# Altium schematic sheet schematic.SchDoc
size A; SheetNumber: 2; SheetTotal: 2
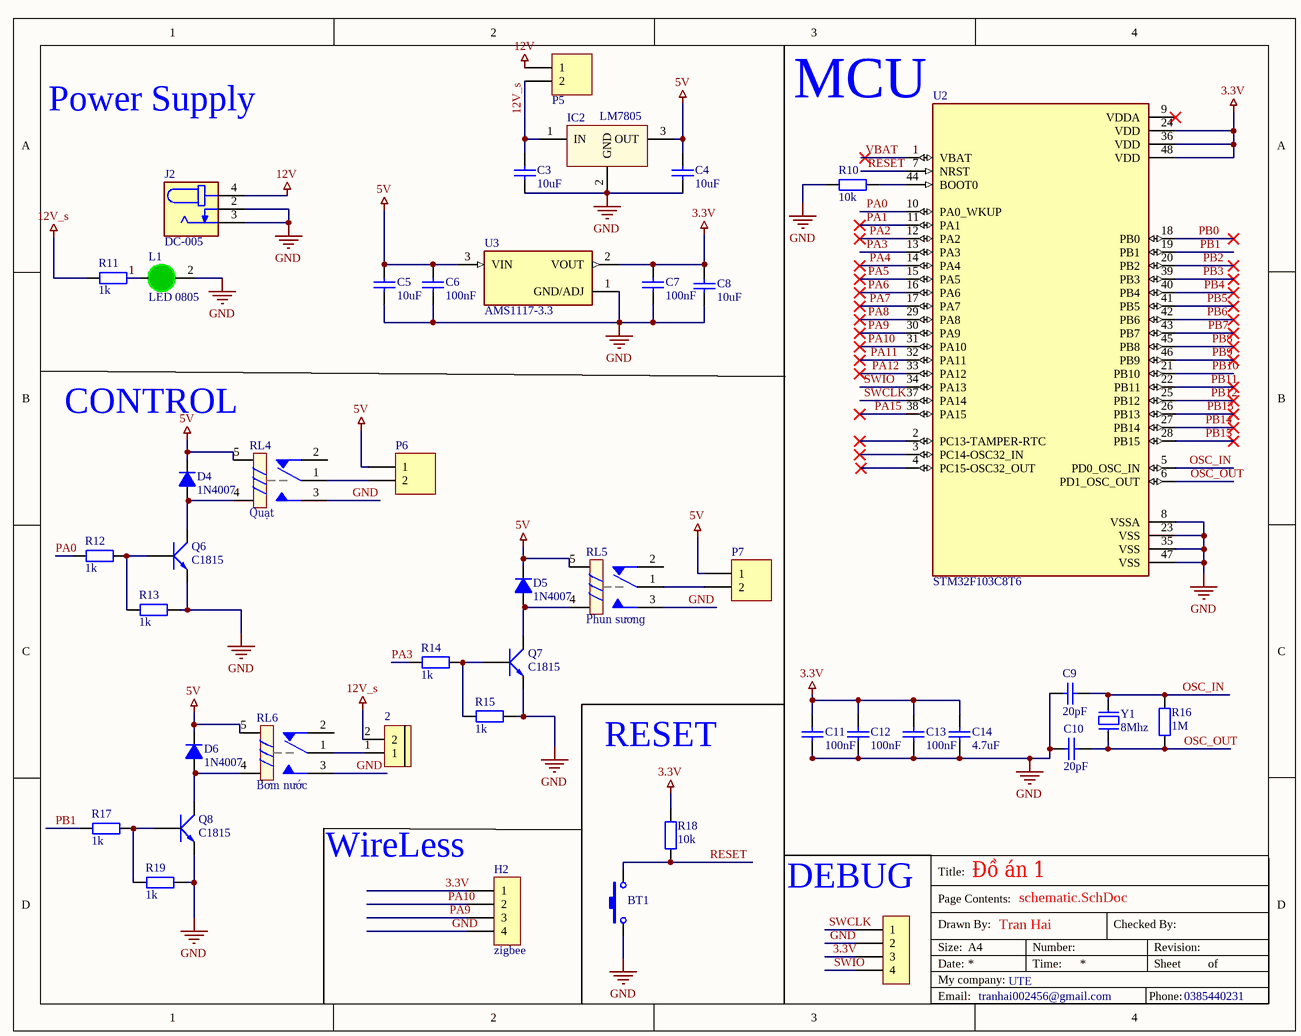
[diagram p0: schematic.SchDoc]

## Parts
2  CON 2 KF301  [Con 2 KF301 5.08]  (value not drawn)
BT1  Nut Nhan 2 Chan SMD 3x6x2.5  [Nut Nhan 2 Chan SMD 3x6x2.5]  (value not drawn)
C3  10uF  [tu 0805]
C4  10uF  [tu 0805]
C5  10uF  [Tu 0805]
C6  100nF  [Tu 0805]
C7  100nF  [Tu 0805]
C8  10uF  [Tu 0805]
C9  20pF  [tu 0805]
C10  20pF  [tu 0805]
C11  100nF  [tu 0805]
C12  100nF  [tu 0805]
C13  100nF  [tu 0805]
C14  4.7uF  [tu 0805]
D4  1N4007  [D1A]
D5  1N4007  [D1A]
D6  1N4007  [D1A]
H2  zigbee  [XH2.54M-4]
H3  Header 4P 2.54 Duc Thang  [XH2.54M-4]  (value not drawn)
IC2  LM7805  [QTO-220]
J2  DC-005  [NINIGI_DC-005]
L1  LED 0805  [LED-0805-Green]
P5  Header 2  [HDR1X2]  (value not drawn)
P6  Header 2  [HDR1X2]  (value not drawn)
P7  Header 2  [HDR1X2]  (value not drawn)
Q6  C1815  [TO92]
Q7  C1815  [TO92]
Q8  C1815  [TO92]
R10  10k  [tro smd 0805]
R11  1k  [tro smd 0805]
R12  1k  [R1/4W]
R13  1k  [R1/4W]
R14  1k  [R1/4W]
R15  1k  [R1/4W]
R16  1M  [tro smd 0805]
R17  1k  [R1/4W]
R18  10k  [tro smd 0805]
R19  1k  [R1/4W]
RL4  Quạt  [Relay 5 Chan SRD]
RL5  Phun sương  [Relay 5 Chan SRD]
RL6  Bơm nước  [Relay 5 Chan SRD]
U2  STM32F103C8T6  [QFP50P900X900X160-48N]
U3  AMS1117-3.3  [SOT229P700X180-4N]
Y1  8Mhz  [Thach Anh 2 chan cam]

## Nets
3.3V: C7.1 C8.1 C11.1 C12.1 C13.1 C14.1 H2.1 H3.3 R18.2 U2.24(VDD) U2.36(VDD) U2.48(VDD) U3.2(VOUT)
5V: C4.1 C5.1 C6.1 D4.2(K) D5.2(K) D6.2(K) IC2.3(OUT) P6.1 P7.1 RL4.5 RL5.5 RL6.5 U3.3(VIN)
12V: J2.4 P5.1
12V_s: 2.2 C3.1 IC2.1(IN) P5.2 R11.1
GND: BT1.1 C3.2 C4.2 C5.2 C6.2 C7.2 C8.2 C9.2 C10.2 C11.2 C12.2 C13.2 C14.2 H2.4 H3.2 IC2.2(GND) J2.2 J2.3 L1.2(K) Q6.1(E) Q7.1(E) Q8.1(E) R10.1 R13.2 R15.2 R19.2 RL4.3 RL5.3 RL6.3 U2.8(VSSA) U2.23(VSS) U2.35(VSS) U2.47(VSS) U3.1(GND/ADJ)
OSC_IN: C9.1 R16.2 U2.5(PD0_OSC_IN) Y1.2
OSC_OUT: C10.1 R16.1 U2.6(PD1_OSC_OUT) Y1.1
PA0: R12.1 U2.10(PA0_WKUP)
PA1: U2.11(PA1)
PA2: U2.12(PA2)
PA3: R14.1 U2.13(PA3)
PA4: U2.14(PA4)
PA5: U2.15(PA5)
PA6: U2.16(PA6)
PA7: U2.17(PA7)
PA8: U2.29(PA8)
PA9: H2.3 U2.30(PA9)
PA10: H2.2 U2.31(PA10)
PA11: U2.32(PA11)
PA12: U2.33(PA12)
PA15: U2.38(PA15)
PB0: U2.18(PB0)
PB1: R17.1 U2.19(PB1)
PB2: U2.20(PB2)
PB3: U2.39(PB3)
PB4: U2.40(PB4)
PB5: U2.41(PB5)
PB6: U2.42(PB6)
PB7: U2.43(PB7)
PB8: U2.45(PB8)
PB9: U2.46(PB9)
PB10: U2.21(PB10)
PB11: U2.22(PB11)
PB12: U2.25(PB12)
PB13: U2.26(PB13)
PB14: U2.27(PB14)
PB15: U2.28(PB15)
RESET: BT1.2 R18.1 U2.7(NRST)
SWCLK: H3.1 U2.37(PA14)
SWIO: H3.4 U2.34(PA13)
VBAT: U2.1(VBAT)
Net2_1: 2.1 RL6.1
NetD4_1: D4.1(A) Q6.2(C) RL4.4
NetD5_1: D5.1(A) Q7.2(C) RL5.4
NetD6_1: D6.1(A) Q8.2(C) RL6.4
NetL1_1: L1.1(A) R11.2
NetP6_2: P6.2 RL4.1
NetP7_2: P7.2 RL5.1
NetQ6_3: Q6.3(B) R12.2 R13.1
NetQ7_3: Q7.3(B) R14.2 R15.1
NetQ8_3: Q8.3(B) R17.2 R19.1
NetR10_2: R10.2 U2.44(BOOT0)

Not connected (* = marked no-connect by the designer): RL4 2; RL5 2; RL6 2; U2 2(PC13-TAMPER-RTC)* 3(PC14-OSC32_IN)* 4(PC15-OSC32_OUT)* 9(VDDA)*

## Notes on the sheet
- Power Supply
- MCU
- CONTROL
- RESET
- (near H2) WireLess
- (near H3) DEBUG
- Đồ án 1
- Title:
- Page Contents:
- Size:
- Date:
- Drawn By:
- My company:
- Email:
- A4
- tranhai002456@gmail.com
- Tran Hai
- UTE
- Number:
- Time:
- Checked By:
- Phone:
- Revision:
- Sheet
- 0385440231
- of

## Library data of the parts
2 = CON 2 KF301: Cắm; Ma_Hang: MH000987; Ten_Linh_Kien: CON 2 KF301-2P 5.08MM Xanh Dương; Chung_Loai: Cắm; Ghi_Chu: *; Kieu_Chan: *; Don_Vi: Con
BT1 = Nut Nhan 2 Chan SMD 3x6x2.5: Ma_Hang: MH001036; Ten: Nút Nhấn 2 Chân 3x6x2.5MM SMD
C3 C4 C9-C14 = Tu 0805 101 50V 20%: Dán; Don_Vi: Con; So_Chan: 2; Ten_Linh_Kien: Tụ 0805 101-0.1nF 50V 20%; Ma_Hang: MH002806; Chung_Loai: Dán; Kieu_Chan: *
C5-C8 = Tu 0805 200pF 50V 10%: Dán; Ten_Linh_Kien: Tụ 0805 200p 10% 50V; Don_Vi: Con; So_Chan: 2; Ma_Hang: MH008100; Chung_Loai: Dán; Kieu_Chan: *
D4-D6 = D1A: Diode 1A; Value: 1N4007
H2 H3 = Header 4P 2.54 Duc Thang: Cắm; Ten_Linh_Kien: Header 4P XH2.54-4P Đực Thẳng; Don_Vi: Con; Ma_Hang: MH001285; Chung_Loai: Cắm
IC2 = LM78xx: On ap +, from + 5 to + 24VDC; Value: LM7805
J2 = DC-005: DC Jack; Availability: Unavailable; MP: DC-005; Value: *; Package: None; Price: None
L1 = LED 0805 Xanh La: Dán; Don_Vi: Con; Ma_Hang: MH002326; Ten_Linh_Kien: LED 0805 Màu Xanh Lá (Green); Ghi_Chu: *; Kieu_Chan: *; Chung_Loai: Dán
P5-P7 = Header 2: Header, 2-Pin; LatestRevisionDate: 17-Jul-2002
  P6 P7: LatestRevisionNote: Re-released for DXP Platform.; Publisher: Altium Limited
Q6-Q8 = C1815: NPN transistor; Value: C9014
R10 R11 R16 R18 = Tro 0805 1% 10k: Dán; Don_Vi: Con; So_Chan: 2; Ten_Linh_Kien: Trở 0805 1% 10k; Ma_Hang: MH005473; Chung_Loai: Dán; Kieu_Chan: *
R12-R15 R17 R19 = R1/4W: Resistor 1/4W; Value: R1/4W - 1K
RL4-RL6 = Relay 5 Chan SRD: Relay 5 Chan; Ma_Hang: MH009374; Ten: Relay 5V10A SRD-05VDC-SL-C Chính Hãng
U2 = STM32F103C8T6: ARM® Cortex®-M3 STM32F1 Microcontroller IC 32-Bit 72MHz 64KB (64K x 8) FLASH 48-LQFP (7x7); MF: STMicroelectronics; SnapEDA_Link: https://www.snapeda.com/parts/STM32F103C8T6/STMicroelectronics/view-part/?ref=snap; Package: LQFP-48 STMicroelectronics; Value: *; MP: STM32F103C8T6; Check_prices: https://www.snapeda.com/parts/STM32F103C8T6/STMicroelectronics/view-part/?ref=eda
U3 = AMS1117-3.3: Sot223/Pkg 1-Amp 3.3-Volt Low Drop Out Voltage Regulatator; MF: Advanced Monolithic Systems; Package: SOT-223 Seeed Technology; Value: *; Check_prices: https://www.snapeda.com/parts/AMS1117-3.3/Advanced+Monolithic+Systems/view-part/?ref=eda; Price: None; Availability: Not in stock; MP: AMS1117-3.3; SnapEDA_Link: https://www.snapeda.com/parts/AMS1117-3.3/Advanced+Monolithic+Systems/view-part/?ref=snap
Y1 = Thach Anh 2 chan Cam: Crystal For all Crystal 2pin.; Value: 4Mhz